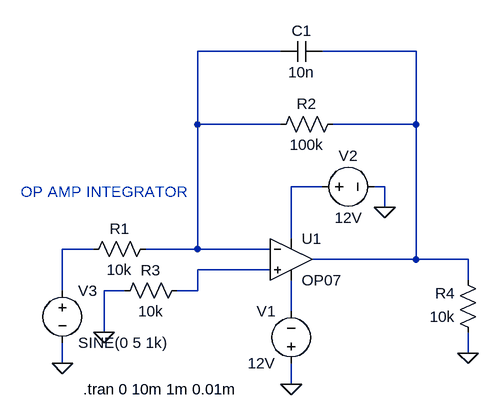
[diagram p0: schematic OP AMP Integrator.asc]
OP AMP Integrator.asc, the LTspice schematic file:
Version 4
SHEET 1 880 680
WIRE 160 -176 32 -176
WIRE 368 -176 224 -176
WIRE 32 -64 32 -176
WIRE 160 -64 32 -64
WIRE 368 -64 368 -176
WIRE 368 -64 240 -64
WIRE 224 32 176 32
WIRE 320 32 304 32
WIRE 320 64 320 32
WIRE 176 112 176 32
WIRE -128 128 -176 128
WIRE 32 128 32 -64
WIRE 32 128 -48 128
WIRE 144 128 32 128
WIRE 368 144 368 -64
WIRE 368 144 208 144
WIRE 448 144 368 144
WIRE 144 160 32 160
WIRE 448 176 448 144
WIRE -176 192 -176 128
WIRE -80 192 -112 192
WIRE 32 192 32 160
WIRE 32 192 0 192
WIRE 176 224 176 176
WIRE -112 256 -112 192
WIRE 448 288 448 256
WIRE -176 304 -176 272
WIRE 176 336 176 304
FLAG 320 64 0
FLAG 176 336 0
FLAG 448 288 0
FLAG -112 256 0
FLAG -176 304 0
SYMBOL OpAmps\\OP07 176 80 R0
SYMATTR InstName U1
SYMBOL res -32 112 R90
WINDOW 0 0 56 VBottom 2
WINDOW 3 32 56 VTop 2
SYMATTR InstName R1
SYMATTR Value 10k
SYMBOL res 256 -80 R90
WINDOW 0 0 56 VBottom 2
WINDOW 3 32 56 VTop 2
SYMATTR InstName R2
SYMATTR Value 100k
SYMBOL res 16 176 R90
WINDOW 0 0 56 VBottom 2
WINDOW 3 32 56 VTop 2
SYMATTR InstName R3
SYMATTR Value 10k
SYMBOL res 464 272 R180
WINDOW 0 36 76 Left 2
WINDOW 3 36 40 Left 2
SYMATTR InstName R4
SYMATTR Value 10k
SYMBOL voltage 176 320 R180
WINDOW 0 24 96 Left 2
WINDOW 3 24 16 Left 2
SYMATTR InstName V1
SYMATTR Value 12V
SYMBOL voltage 208 32 R270
WINDOW 0 32 56 VTop 2
WINDOW 3 -32 56 VBottom 2
SYMATTR InstName V2
SYMATTR Value 12V
SYMBOL voltage -176 176 R0
WINDOW 123 0 0 Left 0
WINDOW 39 0 0 Left 0
SYMATTR InstName V3
SYMATTR Value SINE(0 5 1k)
SYMBOL cap 224 -192 R90
WINDOW 0 0 32 VBottom 2
WINDOW 3 32 32 VTop 2
SYMATTR InstName C1
SYMATTR Value 10n
TEXT -240 40 Left 2 ;OP AMP INTEGRATOR
TEXT -144 344 Left 2 !.tran 0 10m 1m 0.01m

The netlist it stands for:
* OP AMP Integrator.asc
XU1 N005 N001 N003 N006 N002 LT1001  ; OP07, pins In+ In- V+ V- OUT
R1 N001 N004 10k
R2 N002 N001 100k
R3 N005 0 10k
R4 0 N002 10k
V1 0 N006 12V
V2 N003 0 12V
V3 N004 0 SINE(0 5 1k)
C1 N002 N001 10n
* OP AMP INTEGRATOR
.tran 0 10m 1m 0.01m
.lib LTC.lib
.backanno
.end